# Altium schematic sheet Master.SchDoc
size A
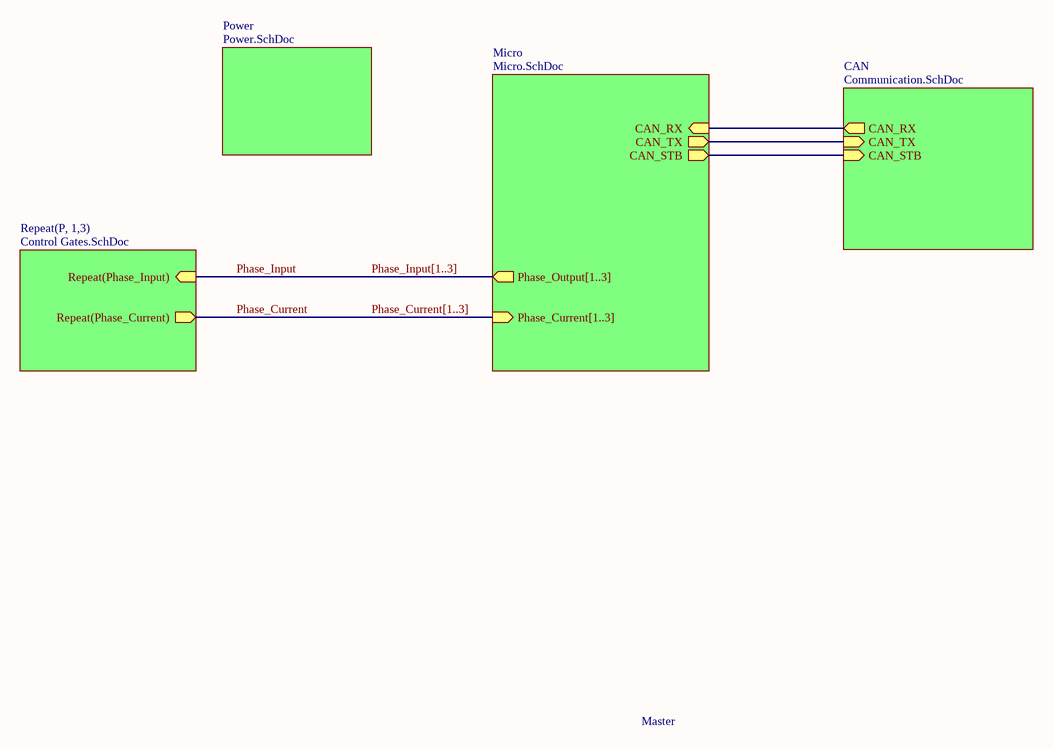
[diagram p0: Master.SchDoc]

## Sub-sheets
CAN = Communication.SchDoc: CAN_RX (out), CAN_TX (in), CAN_STB (in)
Micro = Micro.SchDoc: CAN_RX (in), CAN_TX (out), Phase_Output[1..3] (out), CAN_STB (out), Phase_Current[1..3] (in)
Power = Power.SchDoc: no entries
Repeat(P, 1,3) = Control Gates.SchDoc: Repeat(Phase_Input) (in), Repeat(Phase_Current) (out)

## Nets
Phase_Current: sheet Repeat(P, 1,3)/Repeat(Phase_Current)
Phase_Input: sheet Repeat(P, 1,3)/Repeat(Phase_Input)
(unnamed): sheet CAN/CAN_RX, sheet Micro/CAN_RX
(unnamed): sheet CAN/CAN_TX, sheet Micro/CAN_TX
(unnamed): sheet CAN/CAN_STB, sheet Micro/CAN_STB

## Buses and harness runs
bus Phase_Current[1..3] = sheet Micro/Phase_Current[1..3]
bus Phase_Input[1..3] = sheet Micro/Phase_Output[1..3]

## Notes on the sheet
- Master
- Title
- Size:
- Date:
- A
- Number:
- Time:
- Revision:
- Sheet
- of
- File: